# EAGLE design RFM_Sockel (EAGLE 6.6.0)
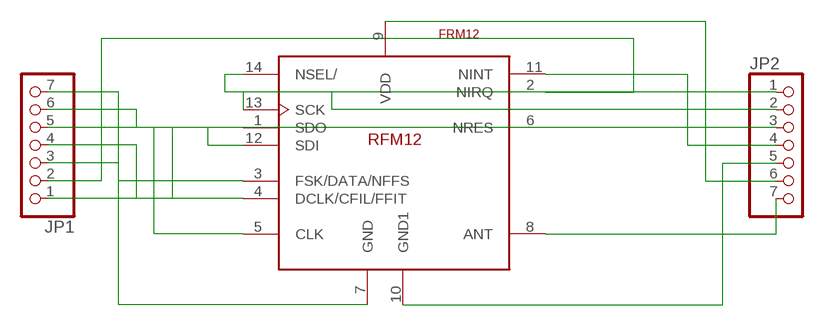
[diagram p0: schematic, sheet 1]

## Parts
JP1  PINHD-1X7  [1X07]
JP2  PINHD-1X7  [1X07]
U$1  FRM12  [RFM12]

## Nets
N$1: JP1.1 U$1.1(SDO)
N$2: JP1.2 U$1.2(NIRQ)
N$3: JP1.3 U$1.3(FSK/DATA/NFFS)
N$4: JP1.4 U$1.4(DCLK/CFIL/FFIT)
N$5: JP1.5 U$1.5(CLK)
N$6: JP1.6 U$1.6(NRES)
N$7: JP1.7 U$1.7(GND)
N$8: JP2.7 U$1.8(ANT)
N$9: JP2.5 U$1.10(GND1)
N$10: JP2.4 U$1.11(NINT)
N$11: JP2.3 U$1.12(SDI)
N$12: JP2.2 U$1.13(SCK)
N$13: JP2.1 U$1.14(NSEL/)
VDD: JP2.6 U$1.9(VDD)

## Library data of the parts
JP1 JP2 = pinhead:PINHD-1X7: PIN HEADER
U$1 = RFM12:FRM12

## Board
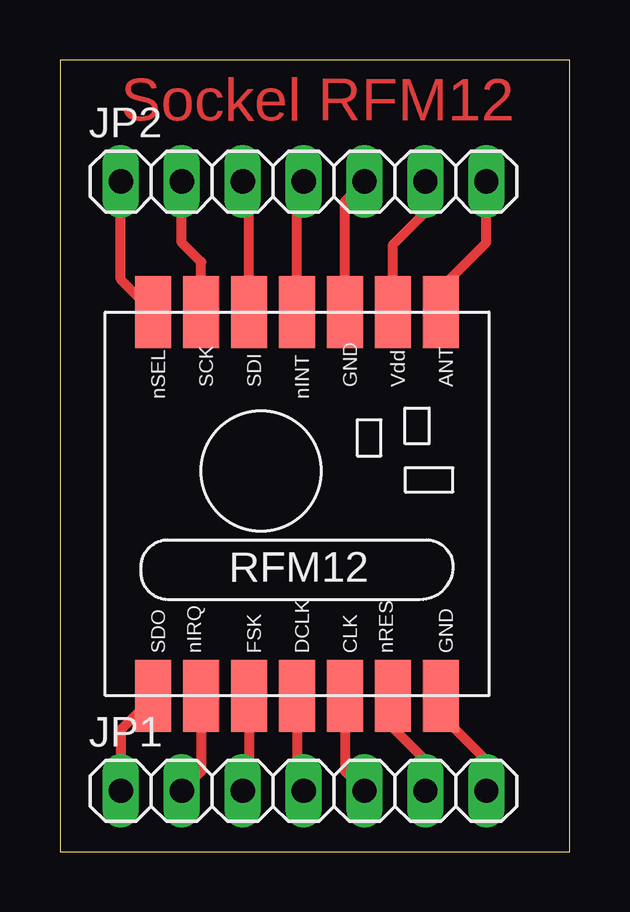
[diagram p1: board, top side]

Size 21.26 x 33.01 mm. Coordinates in mm from the lower left corner, seen from the top.
Outline: 0,0 21.26,0 21.26,33.01 0,33.01 0,0
Copper layers (1*16): Top 0.035mm / dielectric 1.5mm / Bottom 0.035mm
Design rules "default": minimum track width 10mil, minimum drill 24mil, track to track 8mil, track to pad 8mil, pad to pad 8mil, via to via 8mil, smd to smd 8mil, copper to edge 40mil, drill to drill 8mil, minimum pad ring 10mil, minimum via ring 8mil, stop-mask expansion 4mil, vias tented up to drill 0mil, thermal gap 10mil

### Footprints (pad centres in the part's own frame; a part is rotated, then mirrored left to right if it is on the bottom)
1X07 = drill 1.016 long: 1 -7.62,0; 2 -5.08,0; 3 -2.54,0; 4 0,0; 5 2.54,0; 6 5.08,0; 7 7.62,0
RFM12 = smd 1.5 x 3: 1 -5,-10; 2 -3,-10; 3 -1,-10; 4 1,-10; 5 3,-10; 6 5,-10; 7 7,-10; 8 7,6; 9 5,6; 10 3,6; 11 1,6; 12 -1,6; 13 -3,6; 14 -5,6

### Placement (x,y rotation side)
JP1  10.16,2.54 0 top
JP2  10.16,27.94 0 top
U$1  8.89,16.51 0 top

### Tracks (layer width: path | path; a pad name or v marks a point on that pad's centre or on a via)
N$1
  Top 0.406: U$1.1 3.89,6.43 2.54,5.08 JP1.1
N$2
  Top 0.406: U$1.2 5.89,3.35 JP1.2
N$3
  Top 0.406: U$1.3 7.89,2.81 JP1.3
N$4
  Top 0.406: U$1.4 9.89,2.81 JP1.4
N$5
  Top 0.406: U$1.5 11.89,3.35 JP1.5
N$6
  Top 0.406: U$1.6 13.89,5.16 15.24,3.81 JP1.6
N$7
  Top 0.406: U$1.7 15.89,5.7 17.78,3.81 JP1.7
N$8
  Top 0.406: U$1.8 15.89,23.51 17.78,25.4 JP2.7
N$9
  Top 0.406: U$1.10 11.89,27.13 JP2.5
N$10
  Top 0.406: U$1.11 9.89,27.67 JP2.4
N$11
  Top 0.406: U$1.12 7.89,27.67 JP2.3
N$12
  Top 0.406: U$1.13 5.89,24.59 5.08,25.4 JP2.2
N$13
  Top 0.406: U$1.14 2.54,23.86 JP2.1
VDD
  Top 0.406: U$1.9 13.89,25.32 15.24,26.67 JP2.6

### Text on the board
Top: Sockel RFM12